# Altium schematic sheet TPS74401RGWRM3.SchDoc
size A4
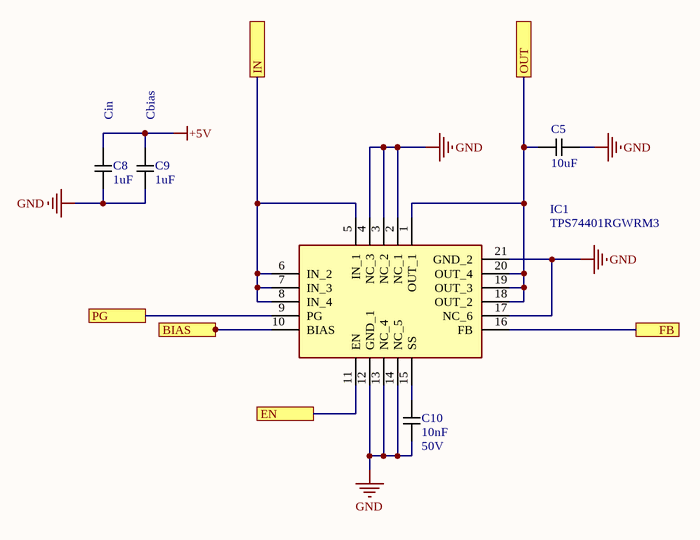
[diagram p0: TPS74401RGWRM3.SchDoc]

## Parts
C5  value 10uF  [C0603_MD]  (hidden comment: Cout)
C8  Cin  value 1uF  [C0603_MD]
C9  Cbias  value 1uF  [C0603_MD]
C10  value 10nF  Voltage: 50V  [C0603_MD]  (hidden comment: CL10B103KB8NNNC)
IC1  TPS74401RGWRM3  [QFN65P500X500X100-21N-D]

## Ports
BIAS, EN, FB, IN, OUT, PG

## Nets
+5V: C8.1 C9.1
GND: C5.1 C8.2 C9.2 C10.2 IC1.2(NC_1) IC1.3(NC_2) IC1.4(NC_3) IC1.12(GND_1) IC1.13(NC_4) IC1.14(NC_5) IC1.17(NC_6) IC1.21(GND_2)
BIAS: IC1.10(BIAS) ; port BIAS
EN: IC1.11(EN) ; port EN
FB: IC1.16(FB) ; port FB
IN: IC1.5(IN_1) IC1.6(IN_2) IC1.7(IN_3) IC1.8(IN_4) ; port IN
OUT: C5.2 IC1.1(OUT_1) IC1.18(OUT_2) IC1.19(OUT_3) IC1.20(OUT_4) ; port OUT
PG: IC1.9(PG) ; port PG
NetC10_1: C10.1 IC1.15(SS)

## Library data of the parts
C5 = GRM188C81C106MA73D: CAP CER 10UF 16V 20% X6S 0603; Manufacturer: Murata Electronics North America; Mount Type: SMD; Category: Ceramic; Dielectric: *; Supplier 1: Digi-Key; Supplier Part Number 1: 490-7198-1-ND; Voltage: 16V
C8 C9 = UMK107BJ105KA-T: CAP CER 1UF 50V 10% X5R 0603; Manufacturer: Taiyo Yuden; Mount Type: SMD; Category: *; Dielectric: *; Supplier 1: Digi-Key; Supplier Part Number 1: 587-2400-1-ND; Voltage: 50V
C10 = CL10B103KB8NNNC: 10000pF 50V Ceramic Capacitor X7R 0603; Manufacturer: Samsung Electro-Mechanics America, Inc.; Mount Type: SMD; Category: Ceramic; Dielectric: X7R; Supplier 1: Digi-Key; Supplier Part Number 1: 1276-1009-1-ND; Supplier 2: Newark; Supplier Part Number 2: 30C5334; Supplier 3: Farnell; Supplier Part Number 3: 2253099
IC1 = TPS74401RGWRM3: Integrated Circuit; Manufacturer_Name: Texas Instruments; Datasheet Link: https://www.ti.com/lit/ds/symlink/tps74401.pdf?ts=1748825387292; Height: 1mm; Manufacturer_Part_Number: TPS74401RGWRM3; Mouser Part Number: 595-TPS74401RGWRM3; Mouser Price/Stock: https://www.mouser.co.uk/ProductDetail/Texas-Instruments/TPS74401RGWRM3?qs=jcD%2FCkGBYeMb5sDaJ6BKNg%3D%3D